# Altium schematic sheet S7CAS-PLEIADES-CARTE-MERE_P01_IO.SchDoc
size Tabloid; DocumentNumber: 10; SheetNumber: 10; SheetTotal: 17; Sheet_Name: IO; Size: 11x17
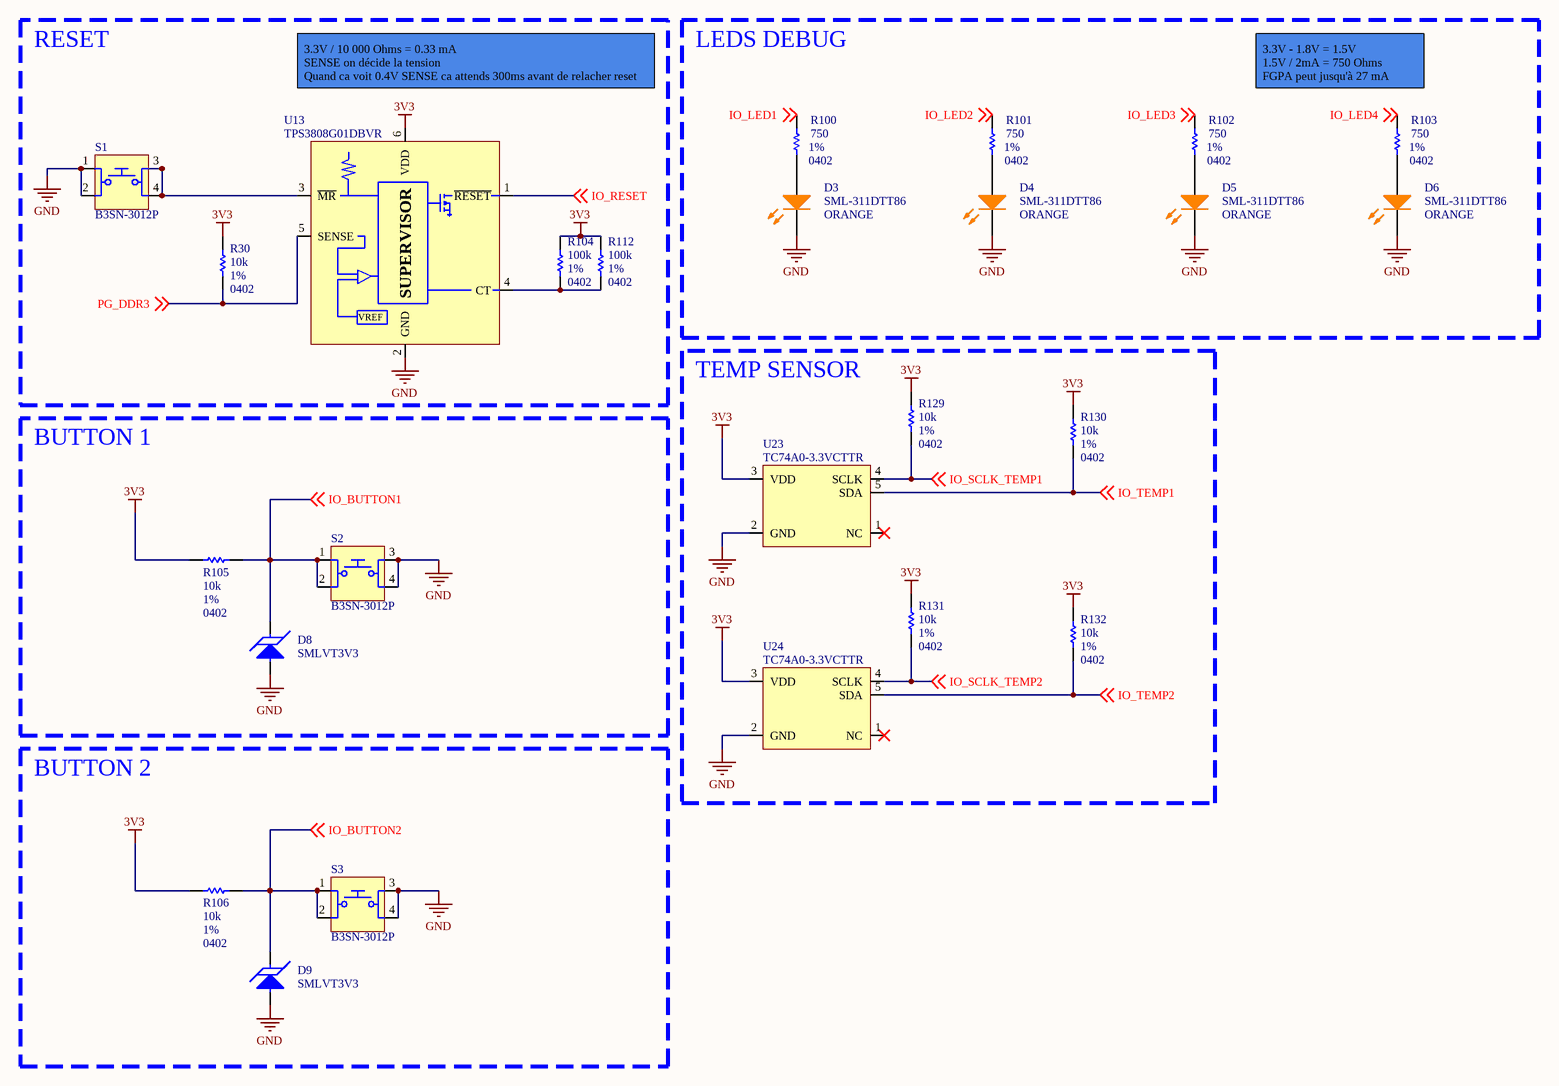
[diagram p0: S7CAS-PLEIADES-CARTE-MERE_P01_IO.SchDoc]

## Parts
D3  SML-311DTT86  value ORANGE  [LED_0603]
D4  SML-311DTT86  value ORANGE  [LED_0603]
D5  SML-311DTT86  value ORANGE  [LED_0603]
D6  SML-311DTT86  value ORANGE  [LED_0603]
D8  SMLVT3V3  [TVS_POW_SMLVT3V3]
D9  SMLVT3V3  [TVS_POW_SMLVT3V3]
R30  value 10k  Package: 0402  Precision: 1%  [RES_0402]  (hidden comment: RES - 0402)
R100  value 750  Package: 0402  Precision: 1%  [RES_0402]  (hidden comment: RES - 0402)
R101  value 750  Package: 0402  Precision: 1%  [RES_0402]  (hidden comment: RES - 0402)
R102  value 750  Package: 0402  Precision: 1%  [RES_0402]  (hidden comment: RES - 0402)
R103  value 750  Package: 0402  Precision: 1%  [RES_0402]  (hidden comment: RES - 0402)
R104  value 100k  Package: 0402  Precision: 1%  [RES_0402]  (hidden comment: RES - 0402)
R105  value 10k  Package: 0402  Precision: 1%  [RES_0402]  (hidden comment: RES - 0402)
R106  value 10k  Package: 0402  Precision: 1%  [RES_0402]  (hidden comment: RES - 0402)
R112  value 100k  Package: 0402  Precision: 1%  [RES_0402]  (hidden comment: RES - 0402)
R129  value 10k  Package: 0402  Precision: 1%  [RES_0402]  (hidden comment: RES - 0402)
R130  value 10k  Package: 0402  Precision: 1%  [RES_0402]  (hidden comment: RES - 0402)
R131  value 10k  Package: 0402  Precision: 1%  [RES_0402]  (hidden comment: RES - 0402)
R132  value 10k  Package: 0402  Precision: 1%  [RES_0402]  (hidden comment: RES - 0402)
S1  B3SN-3012P  [SWI_TACT_B3SN-3012P]
S2  B3SN-3012P  [SWI_TACT_B3SN-3012P]
S3  B3SN-3012P  [SWI_TACT_B3SN-3012P]
U13  TPS3808G01DBVR  [POW_RESET_TPS3808]
U23  TC74A0-3.3VCTTR  [SEN_TEMP_TC74A0-3.3VCTTR]
U24  TC74A0-3.3VCTTR  [SEN_TEMP_TC74A0-3.3VCTTR]

## Blocks framed on the sheet
RESET: R30 R104 R112 S1 U13
LEDS DEBUG: D3-D6 R100-R103
TEMP SENSOR: R129-R132 U23 U24
BUTTON 1: D8 R105 S2
BUTTON 2: D9 R106 S3

## Nets
3V3: R30.2 R104.2 R105.1 R106.1 R112.2 R129.2 R130.2 R131.2 R132.2 U13.6(VDD) U23.3(VDD) U24.3(VDD)
GND: D3.K D4.K D5.K D6.K D8.A D9.A S1.1 S1.2 S2.3 S2.4 S3.3 S3.4 U13.2(GND) U23.2(GND) U24.2(GND)
IO_BUTTON1: D8.K R105.2 S2.1 S2.2 ; off-sheet IO_BUTTON1
IO_BUTTON2: D9.K R106.2 S3.1 S3.2 ; off-sheet IO_BUTTON2
IO_LED1: R100.2 ; off-sheet IO_LED1
IO_LED2: R101.2 ; off-sheet IO_LED2
IO_LED3: R102.2 ; off-sheet IO_LED3
IO_LED4: R103.2 ; off-sheet IO_LED4
IO_RESET: U13.1(~{RESET}) ; off-sheet IO_RESET
IO_SCLK_TEMP1: R129.1 U23.4(SCLK) ; off-sheet IO_SCLK_TEMP1
IO_SCLK_TEMP2: R131.1 U24.4(SCLK) ; off-sheet IO_SCLK_TEMP2
IO_TEMP1: R130.1 U23.5(SDA) ; off-sheet IO_TEMP1
IO_TEMP2: R132.1 U24.5(SDA) ; off-sheet IO_TEMP2
PG_DDR3: R30.1 U13.5(SENSE) ; off-sheet PG_DDR3
NetD3_A: D3.A R100.1
NetD4_A: D4.A R101.1
NetD5_A: D5.A R102.1
NetD6_A: D6.A R103.1
NetR104_1: R104.1 R112.1 U13.4(CT)
NetS1_3: S1.3 S1.4 U13.3(~{MR})

Not connected (* = marked no-connect by the designer): U23 1(NC)*; U24 1(NC)*

## Notes on the sheet
- 3.3V / 10 000 Ohms = 0.33 mA
  SENSE on décide la tension
  Quand ca voit 0.4V SENSE ca attends 300ms avant de relacher reset
- (near R103) 3.3V - 1.8V = 1.5V
  1.5V / 2mA = 750 Ohms
  FGPA peut jusqu'à 27 mA
- Sheet Name
- Project Title
- Global Project
- Size
- Group
- Revision
- Date
- Sheet
- of
- Filename
- Designers
- (in symbol POW_RESET_TPS3808G01DBVR) SUPERVISOR; VREF

## Library data of the parts
D3-D6 = LED_SML-311DTT86: LED - 611nM ORANGE 2mA - 0603; Voltage: 1.8V; Mfg: ROHM Semiconductor; Power: 44mW; Current: 2mA; HelpURL: http://media.digikey.com/pdf/Data%20Sheets/Rohm%20PDFs/SML-311%20Series.pdf; CreatedBy: Jonathan Bouchard; Temperature: -40°C to 85°C; Package: 0603; Precision: *; Mfg Part Number: SML-311DTT86; Supplier 1: Digikey; Supplier Part Number 1: 511-1303-1-ND
D8 D9 = TVS_POW_SMLVT3V3: TVS - 3.3V 10.3V 600W - DO214AA; Manufacturer #1: STMicroelectronics; Value: Vbr = 4.1V -  Clamp = 10.3V; Voltage Rating: 3.3V Standoff; Current Rating: 200A (Ifsm); Power Max: 600W (Ppp); GRAMS Lib Spec: 2.8; Magnetic Material: UNKNOWN; Polarized: YES; Tolerance: *; HelpURL: https://www.st.com/content/ccc/resource/technical/document/datasheet/da/a4/86/90/17/13/47/7c/CD00000923.pdf/files/CD00000923.pdf/jcr:content/translations/en.CD00000923.pdf; CreatedBy/Date: Jonathan Bouchard - 2019-04-27; VerifiedBy: Nicolas V. (2019-05-06); Temperature: -55°C ~ 175°C (TJ); Package: DO214AA; Manufacturer #2: *; Part Number #2: *; Part Number #1: SMLVT3V3; Supplier 1: Digi-Key; Supplier Part Number 1: 497-2496-1-ND; Cryo: UNKNOWN; Mfg Part Number: SMLVT3V3
R30 R105 R106 R129-R132 = RES - 0402: 10 kOhms ±1% 0.063W, 1/16W Chip Resistor 0402 (1005 Metric) Automotive AEC-Q200 Thick Film; Mfg Part Number: RMCF0402FT10K0; Voltage: 75V; Current: *; CreatedBy: Jonathan Bouchard; Power: 1/16W; Part Number #1: RMCF0402FT10K0
R100-R103 = RES - 0402: 750 Ohms ±0.1% 0.063W, 1/16W Chip Resistor 0402 (1005 Metric) Automotive AEC-Q200 Thin Film; Mfg Part Number: ERA-2ARB751X; Voltage: 50V; Mfg: Panasonic Electronic Components; Current: *; CreatedBy: Jonathan Bouchard; Power: 1/16W
R104 R112 = RES - 0402: 100 kOhms ±1% 0.063W, 1/16W Chip Resistor 0402 (1005 Metric) Moisture Resistant Thick Film; Mfg Part Number: RC0402FR-07100KL; Voltage: 75V; Current: *; CreatedBy: Jonathan Bouchard; Power: 1/16W; Part Number #1: RC0402FR-07100KL
S1-S3 = SWI_TACT_B3SN-3012P_1: SWI - SWITCH TACTILE SPST-NO 0.05A 24V -SMD; Manufacturer #1: Omron Electronics Inc-EMC Div; Current Rating: 50mA; Voltage rating: 24VDC; Polarized: No; Magnetic Material: UNKNOWN; GRAMS Lib Spec: 2.8; Manufacturer #2: *; Power Max: *; Value: SPST-NO; Part Number #1: B3SN-3012P; Part Number #2: *; HelpURL: http://omronfs.omron.com/en_US/ecb/products/pdf/en-b3sn.pdf; Supplier 1: Digi-Key; Supplier Part Number 1: SW261CT-ND; Temperature: -25°C ~ 70°C; Package: SMD; CreatedBy/Date: Olivier Bernard / 5/12/2017; Tolerance: *; VerifiedBy: Caroline Paulin / 11 juillet 2018; Cryo: UNKNOWN; Mfg Part Number: B3SN-3012P
U13 = POW_RESET_TPS3808G01DBVR: POW - VOLT SUPERVISOR ADJ - SOT23-6; Mfg: Texas Instruments; Voltage: *; Current: *; Power: *; Mfg Part Number: TPS3808G01DBVR; HelpURL: http://www.ti.com/lit/ds/symlink/tps3808.pdf; CreatedBy: Jonathan Bouchard; Temperature: -40°C ~ 125°C (TJ); Value: *; Precision: *; Package: SOT23-6; Supplier 1: Digikey; Supplier Part Number 1: 296-17188-6-ND
U23 U24 = SENS_TEMP_TC74A0-3.3VCTTR: SENS - TEMPERATURE SENSOR I2C/SMBUS - SOT23-5; Voltage: 2.7 V ~ 5.5 V; Mfg: Microchip; Precision: ±2°C (±3°C); Current: *; Power: *; Mfg Part Number: TC74A0-3.3VCTTR; HelpURL: http://ww1.microchip.com/downloads/en/DeviceDoc/21462D.pdf; CreatedBy: Jonathan Bouchard; Temperature: -40°C ~ 125°C; Value: *; Package: SOT23-5; Supplier 1: Digikey; Supplier Part Number 1: TC74A0-3.3VCTDKR-ND